# Altium project ControlBoard.PrjPcb (part 1 of 8)
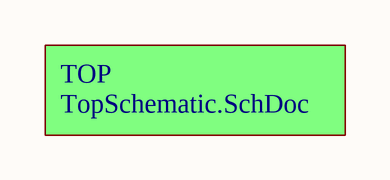
[diagram p0: TitlePage.SchDoc]
17 sheets, 291 parts. Net scope: flat (ports and power ports of the same name join across sheets).
Board file: ControlBoard.PcbDoc
Sheets:
  TitlePage.SchDoc
    TOP = TopSchematic.SchDoc
      U_Mcu = Mcu.SchDoc
        U_McuSupply = McuSupply.SchDoc
      U_CAN = CAN.SchDoc
      U_DIgitalInputs = DIgitalInputs.SchDoc
      U_DigitalOutputs = DigitalOutputs.SchDoc
      U_ExternalConnectors = ExternalConnectors.SchDoc
      U_CAN = CAN.SchDoc
      U_PowerBoardConnector = PowerBoardConnector.SchDoc
      U_Mems = Mems.SchDoc
      U_PhaseCurrents = PhaseCurrents.SchDoc
      U_PositionSense = Resolver.SchDoc
      U_ResistiveTempSensors = ResistiveTempSensors.SchDoc
      U_Supply = Supply.SchDoc
      U_UserInterface = UserInterface.SchDoc
      U_Voltages = Voltages.SchDoc
      U_Encoder = Encoder.SchDoc

## Sheet TitlePage.SchDoc: Title
size A4; SchTemplateVer: V2.0; Author: Adam Mizerkiewicz; CompanyName: Adam Mizerkiewicz; DrawnBy: Adam Mizerkiewicz; Engineer: Adam Mizerkiewicz; Organization: Adam Mizerkiewicz; Address1: Sarnia 2/19; Address2: 61-058 Poznań; Revision: 0.0

### Sub-sheets
TOP = TopSchematic.SchDoc: no entries

### Notes on the sheet
- Revision
  =Revision
- Sheet
  =SheetNumber / =SheetTotal

## Sheet TopSchematic.SchDoc: Title
size A4; SchTemplateVer: V2.0; Author: Adam Mizerkiewicz; CompanyName: Adam Mizerkiewicz; DrawnBy: Adam Mizerkiewicz; Engineer: Adam Mizerkiewicz; Organization: Adam Mizerkiewicz; Address1: Sarnia 2/19; Address2: 61-058 Poznań; Revision: 0.0; SheetNumber: 2; SheetTotal: 18
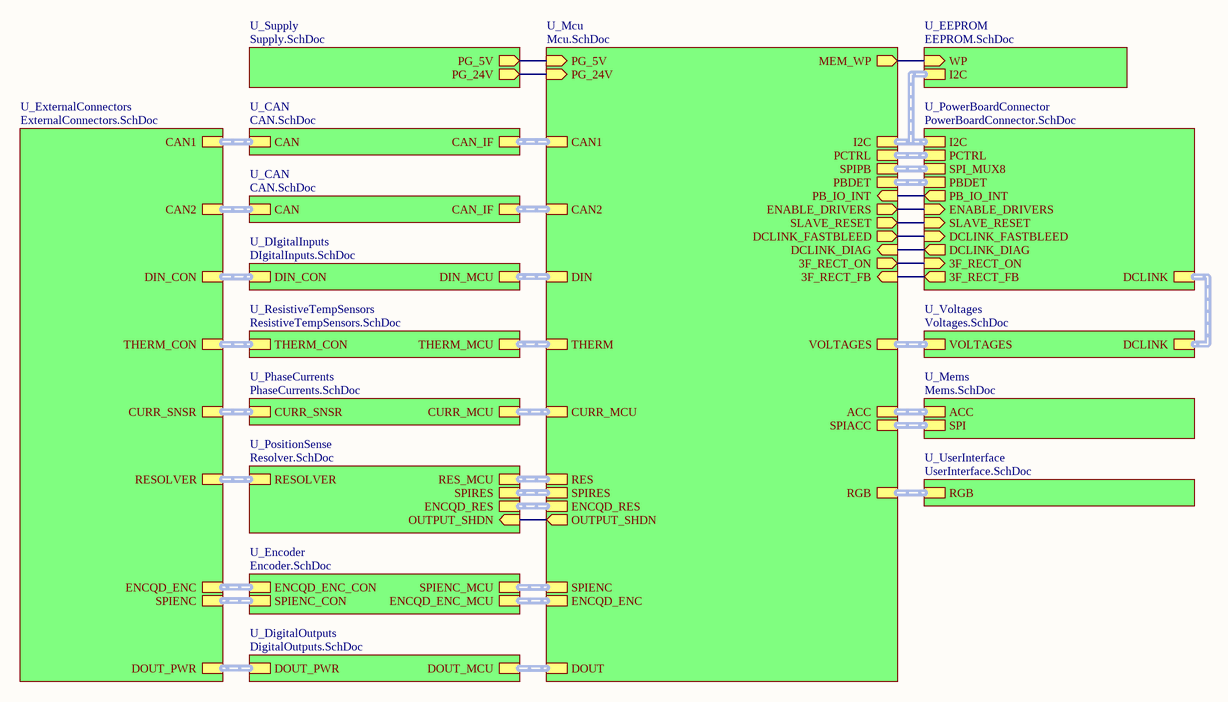
[diagram p1: TopSchematic.SchDoc]

### Sub-sheets
U_CAN = CAN.SchDoc: CAN_IF (harness CAN_IF), CAN (harness CAN)
U_CAN = CAN.SchDoc: CAN_IF (harness CAN_IF), CAN (harness CAN)
U_DIgitalInputs = DIgitalInputs.SchDoc: DIN_CON (harness DIN_CON), DIN_MCU (harness DIN_MCU)
U_DigitalOutputs = DigitalOutputs.SchDoc: DOUT_MCU (harness DOUT_MCU), DOUT_PWR (harness DOUT_PWR)
U_EEPROM = EEPROM.SchDoc (file not in this document): I2C (harness I2C), WP (in)
U_Encoder = Encoder.SchDoc: SPIENC_MCU (harness SPI), ENCQD_ENC_MCU (harness ENCQD), SPIENC_CON (harness SPI), ENCQD_ENC_CON (harness ENCQD)
U_ExternalConnectors = ExternalConnectors.SchDoc: CAN2 (harness CAN), DOUT_PWR (harness DOUT_PWR), DIN_CON (harness DIN_CON), THERM_CON (harness THERM_CON), RESOLVER (harness RESOLVER), SPIENC (harness SPI), CURR_SNSR (harness CURR_SNSR), CAN1 (harness CAN), ENCQD_ENC (harness ENCQD)
U_Mcu = Mcu.SchDoc: CAN1 (harness CAN_IF), CAN2 (harness CAN_IF), PCTRL (harness PCTRL), SPIPB (harness SPI_MUX8), SPIACC (harness SPI), SPIRES (harness SPI), ACC (harness ACC/GYRO), DIN (harness DIN_MCU), I2C (harness I2C), THERM (harness THERM_MCU), PBDET (harness PBDET), DOUT (harness DOUT_MCU), ENCQD_RES (harness ENCQD), SPIENC (harness SPI), RES (harness RESOLVER_IF), DCLINK_FASTBLEED (out), DCLINK_DIAG (in), PB_IO_INT (in), ENABLE_DRIVERS (out), SLAVE_RESET (out), 3F_RECT_ON (out), 3F_RECT_FB (in), VOLTAGES (harness VOLTAGES_MCU), RGB (harness RGB), ENCQD_ENC (harness ENCQD), CURR_MCU (harness CURR_MCU), OUTPUT_SHDN (out), PG_5V (in), PG_24V (in), MEM_WP (out)
U_Mems = Mems.SchDoc: ACC (harness ACC/GYRO_IF), SPI (harness SPI)
U_PhaseCurrents = PhaseCurrents.SchDoc: CURR_SNSR (harness CURR_SNSR), CURR_MCU (harness CURR_MCU)
U_PositionSense = Resolver.SchDoc: RES_MCU (harness RESOLVER_IF), SPIRES (harness SPI), ENCQD_RES (harness ENCQD), RESOLVER (harness RESOLVER), OUTPUT_SHDN (in)
U_PowerBoardConnector = PowerBoardConnector.SchDoc: SPI_MUX8 (harness SPI_MUX8), PCTRL (harness PCTRL), DCLINK_FASTBLEED (in), DCLINK_DIAG (out), PB_IO_INT (out), DCLINK (harness DC_LINK), ENABLE_DRIVERS (in), SLAVE_RESET (in), 3F_RECT_ON (in), 3F_RECT_FB (out), I2C (harness I2C), PBDET (harness PBDET)
U_ResistiveTempSensors = ResistiveTempSensors.SchDoc: THERM_MCU (harness THERM_MCU), THERM_CON (harness THERM_CON)
U_Supply = Supply.SchDoc: PG_5V (out), PG_24V (out)
U_UserInterface = UserInterface.SchDoc: RGB (harness RGB)
U_Voltages = Voltages.SchDoc: DCLINK (harness DCLINK), VOLTAGES (harness VOLTAGES_MCU)

### Nets
(unnamed): sheet U_Mcu/DCLINK_FASTBLEED, sheet U_PowerBoardConnector/DCLINK_FASTBLEED
(unnamed): sheet U_Mcu/DCLINK_DIAG, sheet U_PowerBoardConnector/DCLINK_DIAG
(unnamed): sheet U_Mcu/PB_IO_INT, sheet U_PowerBoardConnector/PB_IO_INT
(unnamed): sheet U_Mcu/ENABLE_DRIVERS, sheet U_PowerBoardConnector/ENABLE_DRIVERS
(unnamed): sheet U_Mcu/SLAVE_RESET, sheet U_PowerBoardConnector/SLAVE_RESET
(unnamed): sheet U_Mcu/3F_RECT_ON, sheet U_PowerBoardConnector/3F_RECT_ON
(unnamed): sheet U_Mcu/3F_RECT_FB, sheet U_PowerBoardConnector/3F_RECT_FB
(unnamed): sheet U_Mcu/OUTPUT_SHDN, sheet U_PositionSense/OUTPUT_SHDN
(unnamed): sheet U_Mcu/PG_5V, sheet U_Supply/PG_5V
(unnamed): sheet U_Mcu/PG_24V, sheet U_Supply/PG_24V
(unnamed): sheet U_Mcu/MEM_WP, sheet U_EEPROM/WP

### Buses and harness runs
harness sheet U_CAN/CAN = sheet U_ExternalConnectors/CAN1
harness sheet U_CAN/CAN = sheet U_ExternalConnectors/CAN2
harness sheet U_CAN/CAN_IF = sheet U_Mcu/CAN1
harness sheet U_CAN/CAN_IF = sheet U_Mcu/CAN2
harness sheet U_DIgitalInputs/DIN_CON = sheet U_ExternalConnectors/DIN_CON
harness sheet U_DIgitalInputs/DIN_MCU = sheet U_Mcu/DIN
harness sheet U_DigitalOutputs/DOUT_MCU = sheet U_Mcu/DOUT
harness sheet U_DigitalOutputs/DOUT_PWR = sheet U_ExternalConnectors/DOUT_PWR
harness sheet U_EEPROM/I2C = sheet U_Mcu/I2C = sheet U_PowerBoardConnector/I2C
harness sheet U_Encoder/ENCQD_ENC_CON = sheet U_ExternalConnectors/ENCQD_ENC
harness sheet U_Encoder/ENCQD_ENC_MCU = sheet U_Mcu/ENCQD_ENC
harness sheet U_Encoder/SPIENC_CON = sheet U_ExternalConnectors/SPIENC
harness sheet U_Encoder/SPIENC_MCU = sheet U_Mcu/SPIENC
harness sheet U_ExternalConnectors/CURR_SNSR = sheet U_PhaseCurrents/CURR_SNSR
harness sheet U_ExternalConnectors/RESOLVER = sheet U_PositionSense/RESOLVER
harness sheet U_ExternalConnectors/THERM_CON = sheet U_ResistiveTempSensors/THERM_CON
harness sheet U_Mcu/ACC = sheet U_Mems/ACC
harness sheet U_Mcu/CURR_MCU = sheet U_PhaseCurrents/CURR_MCU
harness sheet U_Mcu/ENCQD_RES = sheet U_PositionSense/ENCQD_RES
harness sheet U_Mcu/PBDET = sheet U_PowerBoardConnector/PBDET
harness sheet U_Mcu/PCTRL = sheet U_PowerBoardConnector/PCTRL
harness sheet U_Mcu/RES = sheet U_PositionSense/RES_MCU
harness sheet U_Mcu/RGB = sheet U_UserInterface/RGB
harness sheet U_Mcu/SPIACC = sheet U_Mems/SPI
harness sheet U_Mcu/SPIPB = sheet U_PowerBoardConnector/SPI_MUX8
harness sheet U_Mcu/SPIRES = sheet U_PositionSense/SPIRES
harness sheet U_Mcu/THERM = sheet U_ResistiveTempSensors/THERM_MCU
harness sheet U_Mcu/VOLTAGES = sheet U_Voltages/VOLTAGES
harness sheet U_PowerBoardConnector/DCLINK = sheet U_Voltages/DCLINK

### Notes on the sheet
- Revision
  =Revision
- Sheet
  =SheetNumber / =SheetTotal

## Sheet Mcu.SchDoc: Title
size A4; SchTemplateVer: V2.0; Author: Adam Mizerkiewicz; CompanyName: Adam Mizerkiewicz; DrawnBy: Adam Mizerkiewicz; Engineer: Adam Mizerkiewicz; Organization: Adam Mizerkiewicz; Address1: Sarnia 2/19; Address2: 61-058 Poznań; Revision: 0.0; SheetNumber: 3; SheetTotal: 18
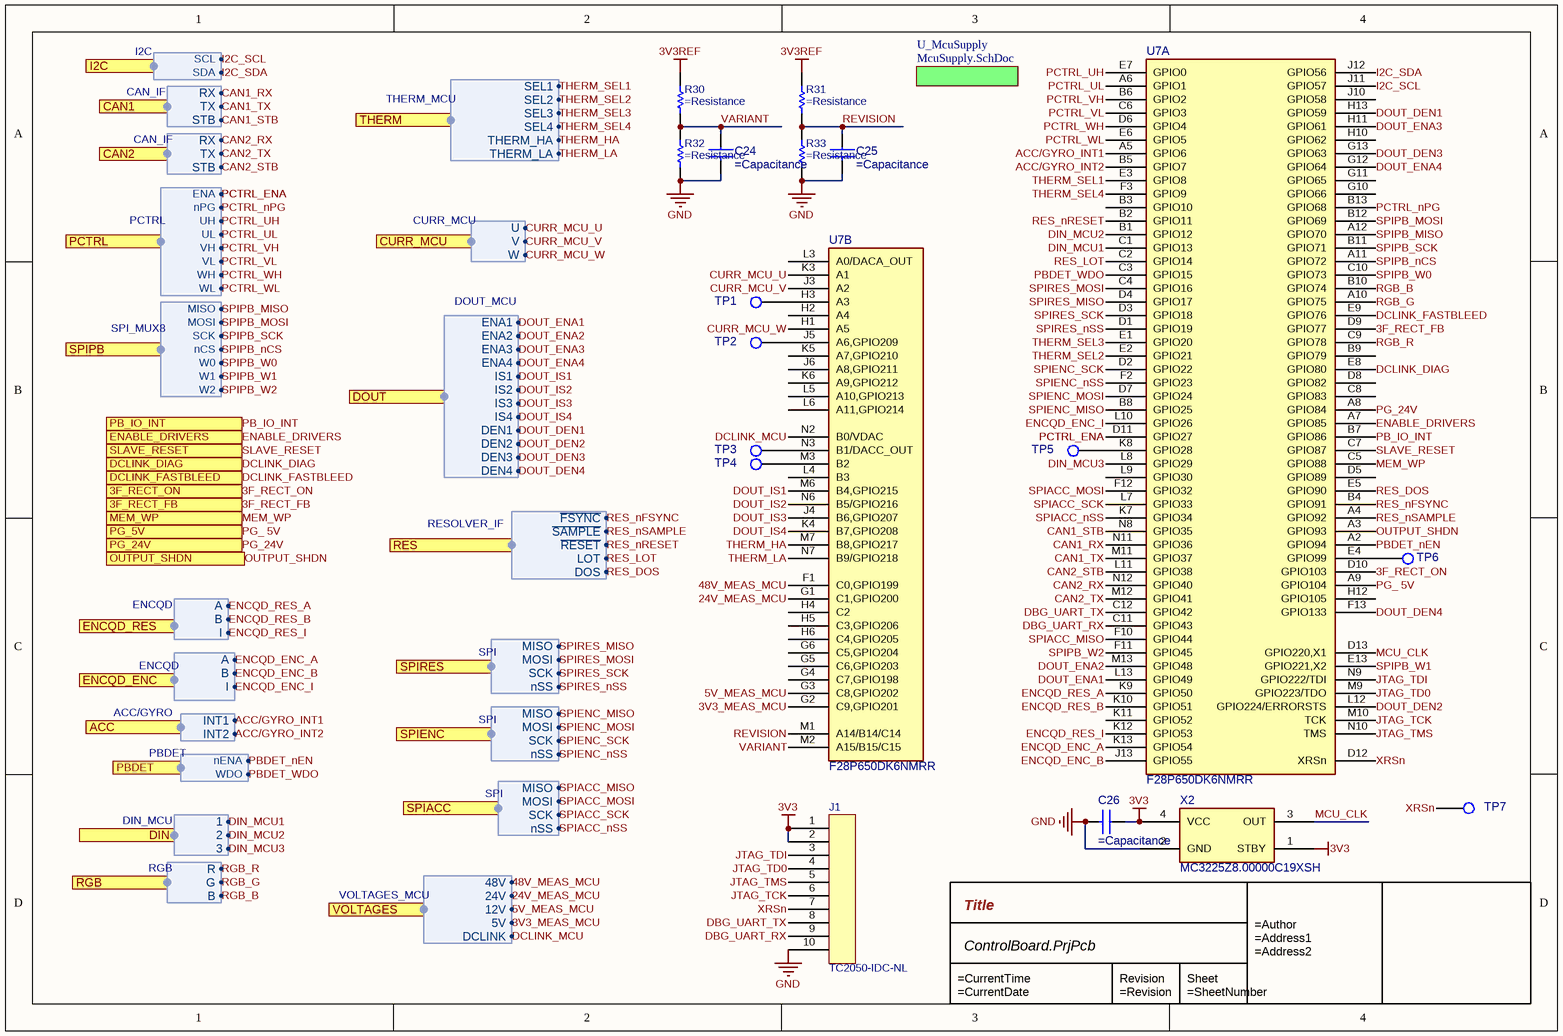
[diagram p2: Mcu.SchDoc]

### Parts
C24  (no value)  [C0402]
C25  (no value)  [C0402]
C26  (no value)  [C0402]
J1  TC2050-IDC-NL  [TC2050-IDC-NL]  (no BOM)
R30  (no value)  [R0402]
R31  (no value)  [R0402]
R32  (no value)  [R0402]
R33  (no value)  [R0402]
TP1  TP_SMT  [TP_SMT]  (value not drawn)  (no BOM)
TP2  TP_SMT  [TP_SMT]  (value not drawn)  (no BOM)
TP3  TP_SMT  [TP_SMT]  (value not drawn)  (no BOM)
TP4  TP_SMT  [TP_SMT]  (value not drawn)  (no BOM)
TP5  TP_SMT  [TP_SMT]  (value not drawn)  (no BOM)
TP6  TP_SMT  [TP_SMT]  (value not drawn)  (no BOM)
TP7  TP_SMT  [TP_SMT]  (value not drawn)  (no BOM)
U7  F28P650DK6NMRR  [NFBGA169]  (parts A,B of 3)
X2  MC3225Z8.00000C19XSH  [MC3225Z]

### Sub-sheets
U_McuSupply = McuSupply.SchDoc: no entries

### Ports
3F_RECT_FB (in), 3F_RECT_ON (out), ACC (harness ACC/GYRO), CAN1 (harness CAN_IF), CAN2 (harness CAN_IF), CURR_MCU (harness CURR_MCU), DCLINK_DIAG (in), DCLINK_FASTBLEED (out), DIN (harness DIN_MCU), DOUT (harness DOUT_MCU), ENABLE_DRIVERS (out), ENCQD_ENC (harness ENCQD), ENCQD_RES (harness ENCQD), I2C (harness I2C), MEM_WP (out), OUTPUT_SHDN (out), PB_IO_INT (in), PBDET (harness PBDET), PCTRL (harness PCTRL), PG_5V (in), PG_24V (in), RES (harness RESOLVER_IF), RGB (harness RGB), SLAVE_RESET (out), SPIACC (harness SPI), SPIENC (harness SPI), SPIPB (harness SPI_MUX8), SPIRES (harness SPI), THERM (harness THERM_MCU), VOLTAGES (harness VOLTAGES_MCU)

### Harnesses
CAN_IF: RX, TX, STB
SPI: MISO, MOSI, SCK, nSS
ACC/GYRO: INT1, INT2
SPI_MUX8: nCS, SCK, MISO, MOSI, W0, W1, W2
I2C: SDA, SCL
PCTRL: UH, UL, VH, VL, WH, WL, ENA, nPG
ENCQD: B, A, I
DIN_MCU: 1, 2, 3
PBDET: WDO, nENA
DOUT_MCU: ENA1, DEN1, ENA2, ENA3, ENA4, IS1, IS2, IS3, IS4, DEN2, DEN3, DEN4
RESOLVER_IF: ~{SAMPLE}, ~{FSYNC}, ~{RESET}, LOT, DOS
RGB: R, G, B
CURR_MCU: V, U, W
VOLTAGES_MCU: 24V, 12V, 5V, DCLINK, 48V
THERM_MCU: SEL1, SEL2, SEL3, SEL4, THERM_HA, THERM_LA

### Nets
3V3: C26.1 J1.1 J1.2 X2.1(STBY) X2.4(VCC)
3V3REF: R30.2 R31.2
GND: C24.2 C25.2 C26.2 J1.10 R32.1 R33.1 X2.2(GND)
3F_RECT_FB: U7.D9(GPIO77) ; port 3F_RECT_FB
3F_RECT_ON: U7.D10(GPIO103) ; port 3F_RECT_ON
3V3_MEAS_MCU: U7.G2(C9,GPIO201) ; port VOLTAGES.5V
5V_MEAS_MCU: U7.G3(C8,GPIO202) ; port VOLTAGES.12V
24V_MEAS_MCU: U7.G1(C1,GPIO200) ; port VOLTAGES.24V
48V_MEAS_MCU: U7.F1(C0,GPIO199) ; port VOLTAGES.48V
ACC/GYRO_INT1: U7.A5(GPIO6) ; port ACC.INT1
ACC/GYRO_INT2: U7.B5(GPIO7) ; port ACC.INT2
CAN1_RX: U7.N11(GPIO36) ; port CAN1.RX
CAN1_STB: U7.N8(GPIO35) ; port CAN1.STB
CAN1_TX: U7.M11(GPIO37) ; port CAN1.TX
CAN2_RX: U7.N12(GPIO40) ; port CAN2.RX
CAN2_STB: U7.L11(GPIO38) ; port CAN2.STB
CAN2_TX: U7.M12(GPIO41) ; port CAN2.TX
CURR_MCU_U: U7.K3(A1) ; port CURR_MCU.U
CURR_MCU_V: U7.J3(A2) ; port CURR_MCU.V
CURR_MCU_W: U7.H1(A5) ; port CURR_MCU.W
DBG_UART_RX: J1.9 U7.C11(GPIO43)
DBG_UART_TX: J1.8 U7.C12(GPIO42)
DCLINK_DIAG: U7.E8(GPIO80) ; port DCLINK_DIAG
DCLINK_FASTBLEED: U7.E9(GPIO76) ; port DCLINK_FASTBLEED
DCLINK_MCU: U7.N2(B0/VDAC) ; port VOLTAGES.DCLINK
DIN_MCU1: U7.C1(GPIO13) ; port DIN.1
DIN_MCU2: U7.B1(GPIO12) ; port DIN.2
DIN_MCU3: U7.L8(GPIO29) ; port DIN.3
DOUT_DEN1: U7.H13(GPIO59) ; port DOUT.DEN1
DOUT_DEN2: U7.L12(GPIO224/ERRORSTS) ; port DOUT.DEN2
DOUT_DEN3: U7.G13(GPIO63) ; port DOUT.DEN3
DOUT_DEN4: U7.F13(GPIO133) ; port DOUT.DEN4
DOUT_ENA1: U7.L13(GPIO49) ; port DOUT.ENA1
DOUT_ENA2: U7.M13(GPIO48) ; port DOUT.ENA2
DOUT_ENA3: U7.H11(GPIO61) ; port DOUT.ENA3
DOUT_ENA4: U7.G12(GPIO64) ; port DOUT.ENA4
DOUT_IS1: U7.M6(B4,GPIO215) ; port DOUT.IS1
DOUT_IS2: U7.N6(B5/GPIO216) ; port DOUT.IS2
DOUT_IS3: U7.J4(B6,GPIO207) ; port DOUT.IS3
DOUT_IS4: U7.K4(B7,GPIO208) ; port DOUT.IS4
ENABLE_DRIVERS: U7.A7(GPIO85) ; port ENABLE_DRIVERS
ENCQD_ENC_A: U7.K13(GPIO54) ; port ENCQD_ENC.A
ENCQD_ENC_B: U7.J13(GPIO55) ; port ENCQD_ENC.B
ENCQD_ENC_I: U7.L10(GPIO26) ; port ENCQD_ENC.I
ENCQD_RES_A: U7.K9(GPIO50) ; port ENCQD_RES.A
ENCQD_RES_B: U7.K10(GPIO51) ; port ENCQD_RES.B
ENCQD_RES_I: U7.K12(GPIO53) ; port ENCQD_RES.I
I2C_SCL: U7.J11(GPIO57) ; port I2C.SCL
I2C_SDA: U7.J12(GPIO56) ; port I2C.SDA
JTAG_TCK: J1.6 U7.M10(TCK)
JTAG_TD0: J1.4 U7.M9(GPIO223/TDO)
JTAG_TDI: J1.3 U7.N9(GPIO222/TDI)
JTAG_TMS: J1.5 U7.N10(TMS)
MCU_CLK: U7.D13(GPIO220,X1) X2.3(OUT)
MEM_WP: U7.C5(GPIO88) ; port MEM_WP
OUTPUT_SHDN: U7.A3(GPIO93) ; port OUTPUT_SHDN
PB_IO_INT: U7.B7(GPIO86) ; port PB_IO_INT
PBDET_nEN: U7.A2(GPIO94) ; port PBDET.nENA
PBDET_WDO: U7.C3(GPIO15) ; port PBDET.WDO
PCTRL_ENA: U7.D11(GPIO27) ; port PCTRL.ENA
PCTRL_nPG: U7.B13(GPIO68) ; port PCTRL.nPG
PCTRL_UH: U7.E7(GPIO0) ; port PCTRL.UH
PCTRL_UL: U7.A6(GPIO1) ; port PCTRL.UL
PCTRL_VH: U7.B6(GPIO2) ; port PCTRL.VH
PCTRL_VL: U7.C6(GPIO3) ; port PCTRL.VL
PCTRL_WH: U7.D6(GPIO4) ; port PCTRL.WH
PCTRL_WL: U7.E6(GPIO5) ; port PCTRL.WL
PG_24V: U7.A8(GPIO84) ; port PG_24V
PG_ 5V: U7.A9(GPIO104) ; port PG_5V
RES_DOS: U7.E5(GPIO90) ; port RES.DOS
RES_LOT: U7.C2(GPIO14) ; port RES.LOT
RES_nFSYNC: U7.B4(GPIO91) ; port RES.~{FSYNC}
RES_nRESET: U7.B2(GPIO11) ; port RES.~{RESET}
RES_nSAMPLE: U7.A4(GPIO92) ; port RES.~{SAMPLE}
REVISION: C25.1 R31.1 R33.2 U7.M1(A14/B14/C14)
RGB_B: U7.B10(GPIO74) ; port RGB.B
RGB_G: U7.A10(GPIO75) ; port RGB.G
RGB_R: U7.C9(GPIO78) ; port RGB.R
SLAVE_RESET: U7.C7(GPIO87) ; port SLAVE_RESET
SPIACC_MISO: U7.F10(GPIO44) ; port SPIACC.MISO
SPIACC_MOSI: U7.F12(GPIO32) ; port SPIACC.MOSI
SPIACC_nSS: U7.K7(GPIO34) ; port SPIACC.nSS
SPIACC_SCK: U7.L7(GPIO33) ; port SPIACC.SCK
SPIENC_MISO: U7.B8(GPIO25) ; port SPIENC.MISO
SPIENC_MOSI: U7.D7(GPIO24) ; port SPIENC.MOSI
SPIENC_nSS: U7.F2(GPIO23) ; port SPIENC.nSS
SPIENC_SCK: U7.D2(GPIO22) ; port SPIENC.SCK
SPIPB_MISO: U7.A12(GPIO70) ; port SPIPB.MISO
SPIPB_MOSI: U7.B12(GPIO69) ; port SPIPB.MOSI
SPIPB_nCS: U7.A11(GPIO72) ; port SPIPB.nCS
SPIPB_SCK: U7.B11(GPIO71) ; port SPIPB.SCK
SPIPB_W0: U7.C10(GPIO73) ; port SPIPB.W0
SPIPB_W1: U7.E13(GPIO221,X2) ; port SPIPB.W1
SPIPB_W2: U7.F11(GPIO45) ; port SPIPB.W2
SPIRES_MISO: U7.D4(GPIO17) ; port SPIRES.MISO
SPIRES_MOSI: U7.C4(GPIO16) ; port SPIRES.MOSI
SPIRES_nSS: U7.D1(GPIO19) ; port SPIRES.nSS
SPIRES_SCK: U7.D3(GPIO18) ; port SPIRES.SCK
THERM_HA: U7.M7(B8,GPIO217) ; port THERM.THERM_HA
THERM_LA: U7.N7(B9/GPIO218) ; port THERM.THERM_LA
THERM_SEL1: U7.E3(GPIO8) ; port THERM.SEL1
THERM_SEL2: U7.E2(GPIO21) ; port THERM.SEL2
THERM_SEL3: U7.E1(GPIO20) ; port THERM.SEL3
THERM_SEL4: U7.F3(GPIO9) ; port THERM.SEL4
VARIANT: C24.1 R30.1 R32.2 U7.M2(A15/B15/C15)
XRSn: J1.7 TP7.1 U7.D12(XRSn)
NetTP1_1: TP1.1 U7.H3(A3)
NetTP2_1: TP2.1 U7.J5(A6,GPIO209)
NetTP3_1: TP3.1 U7.N3(B1/DACC_OUT)
NetTP4_1: TP4.1 U7.M3(B2)
NetTP5_1: TP5.1 U7.K8(GPIO28)
NetTP6_1: TP6.1 U7.E4(GPIO99)

Not connected (* = marked no-connect by the designer): U7 B3(GPIO10) B9(GPIO79) C8(GPIO83) D5(GPIO89) D8(GPIO82) G4(C7,GPIO198) G5(C6,GPIO203) G6(C5,GPIO204) G10(GPIO66) G11(GPIO65) H2(A4) H4(C2) H5(C3,GPIO206) H6(C4,GPIO205) H10(GPIO62) H12(GPIO105) J6(A8,GPIO211) J10(GPIO58) K5(A7,GPIO210) K6(A9,GPIO212) K11(GPIO52) L3(A0/DACA_OUT) L4(B3) L5(A10,GPIO213) L6(A11,GPIO214) L9(GPIO30)

### Notes on the sheet
- Revision
  =Revision
- Sheet
  =SheetNumber / =SheetTotal

### Library data of the parts
C24 C25 = CAP0402-0.1uF-50V: Multilayer Ceramic Capacitors MLCC - SMD/SMT 50V 1000pF C0G 0402 2%; Manufacturer: Walsin Technologies; Manufacturer Part Number: 0402B104K500CT; Capacitance: 100nF; Material: 4241ConductorMaterial; Value: 100nF; Tolerance: 10%; Dielectric: 1511DielectricType; Supplier: Digikey; Supplier Part Number: 1292-1176-1-ND; RoHS: Yes; Category: Ceramic Capacitors; Stock: 109567; Pricing: 1=0,08, 10=0,005, 100=0,0032, 1000=0,0024 (USD); Mounting Technology: Surface Mount; Case/Package: 0402; Case Code (Imperial): 0402; Case Code (Metric): 1005; Min Operating Temperature: -55°C; Max Operating Temperature: 125°C; Packaging: Cut Tape; Voltage Rating: 50V; Series: -; Voltage Rating (DC): 50V; Height: 550um; RoHS Compliant: Yes; Lead Free: 5697LeadFree; ComponentLink1URL: http://datasheet.octopart.com/0402B104K500CT-Walsin-Technologies-datasheet-26371553.pdf?src-supplier=Arrow+Electronics; ComponentLink1Description: http://datasheet.octopart.com/0402B104K500CT-Walsin-Technologies-datasheet-26371553.pdf?src-supplier=Arrow+Electronics; ComponentLink2URL: http://datasheet.octopart.com/0402B104K500CT-Walsin-Technologies-datasheet-26371553.pdf?src-supplier=Verical; ComponentLink2Description: http://datasheet.octopart.com/0402B104K500CT-Walsin-Technologies-datasheet-26371553.pdf?src-supplier=Verical; ComponentLink3URL: http://www.passivecomponent.com/indexsea/0402B104K500CT-IE.pdf?src-supplier=Digikey; ComponentLink3Description: http://www.passivecomponent.com/indexsea/0402B104K500CT-IE.pdf?src-supplier=Digikey; ComponentLink4URL: http://datasheet.octopart.com/0402B104K500CT-Walsin-Technologies-datasheet-26371553.pdf?src-supplier=Rs; ComponentLink4Description: http://datasheet.octopart.com/0402B104K500CT-Walsin-Technologies-datasheet-26371553.pdf?src-supplier=Rs; ComponentLink5URL: https://datasheet.octopart.com/0402B104K500CT-Walsin-Technologies-datasheet-128065749.pdf?src-supplier=Future+Electronics; ComponentLink5Description: https://datasheet.octopart.com/0402B104K500CT-Walsin-Technologies-datasheet-128065749.pdf?src-supplier=Future+Electronics; ComponentLink6URL: http://datasheet.octopart.com/0402B104K500CT-Walsin-Technologies-datasheet-26371553.pdf?src-supplier=Farnell; ComponentLink6Description: http://datasheet.octopart.com/0402B104K500CT-Walsin-Technologies-datasheet-26371553.pdf?src-supplier=Farnell; ComponentLink7URL: http://datasheet.octopart.com/0402B104K500CT-Walsin-Technologies-datasheet-26371553.pdf?src-supplier=Newark; ComponentLink7Description: http://datasheet.octopart.com/0402B104K500CT-Walsin-Technologies-datasheet-26371553.pdf?src-supplier=Newark; ComponentLink8URL: http://datasheet.octopart.com/0402B104K500CT-Walsin-Technologies-datasheet-26371553.pdf?src-supplier=Mouser; ComponentLink8Description: http://datasheet.octopart.com/0402B104K500CT-Walsin-Technologies-datasheet-26371553.pdf?src-supplier=Mouser; ComponentLink9URL: http://datasheet.octopart.com/0402B104K500CT-Walsin-Technologies-datasheet-26371553.pdf?src-supplier=Digikey; ComponentLink9Description: http://datasheet.octopart.com/0402B104K500CT-Walsin-Technologies-datasheet-26371553.pdf?src-supplier=Digikey; ComponentLink10URL: https://datasheet.octopart.com/0402B104K500CT-Walsin-Technologies-datasheet-62066062.pdf?src-supplier=TME; ComponentLink10Description: https://datasheet.octopart.com/0402B104K500CT-Walsin-Technologies-datasheet-62066062.pdf?src-supplier=TME; ComponentLink11URL: http://datasheet.octopart.com/0402B104K500CT-Walsin-Technologies-datasheet-26371553.pdf?src-supplier=Freelance+Electronics; ComponentLink11Description: http://datasheet.octopart.com/0402B104K500CT-Walsin-Technologies-datasheet-26371553.pdf?src-supplier=Freelance+Electronics; ComponentLink12URL: http://datasheet.octopart.com/0402B104K500CT-Walsin-Technologies-datasheet-26371553.pdf?src-supplier=Component+Sense; ComponentLink12Description: http://datasheet.octopart.com/0402B104K500CT-Walsin-Technologies-datasheet-26371553.pdf?src-supplier=Component+Sense; ComponentLink13URL: http://datasheet.octopart.com/0402B104K500CT-Walsin-Technologies-datasheet-26371553.pdf?src-supplier=NAC+Semi; ComponentLink13Description: http://datasheet.octopart.com/0402B104K500CT-Walsin-Technologies-datasheet-26371553.pdf?src-supplier=NAC+Semi; ComponentLink14URL: https://datasheet.octopart.com/0402B104K500CT-Walsin-Technologies-datasheet-136037192.pdf?src-supplier=TECHDesign; ComponentLink14Description: https://datasheet.octopart.com/0402B104K500CT-Walsin-Technologies-datasheet-136037192.pdf?src-supplier=TECHDesign; Supplier 1: Digikey; Supplier Part Number 1: 1292-1176-1-ND; China RoHS: Compliant; Depth: 500µm; Dielectric Material: Ceramic; Length: 1mm; Lifecycle Status: Production; Pins: 2; Number of Terminals: 2; REACH SVHC: Yes; Termination: SMD/SMT; Thickness: 558.8µm; Width: 500µm; ComponentLink15URL: https://datasheet.octopart.com:443/C0402C102G5GACTU-KEMET-datasheet-178132257.pdf?src-supplier=IHS; ComponentLink15Description: https://datasheet.octopart.com:443/C0402C102G5GACTU-KEMET-datasheet-178132257.pdf?src-supplier=IHS; ComponentLink16URL: https://datasheet.octopart.com:443/C0402C102G5GAC7867-KEMET-datasheet-10540709.pdf?src-supplier=IHS; ComponentLink16Description: https://datasheet.octopart.com:443/C0402C102G5GAC7867-KEMET-datasheet-10540709.pdf?src-supplier=IHS; ComponentLink17URL: https://datasheet.octopart.com:443/C0402C102G5GACTU-KEMET-datasheet-137357759.pdf?src-supplier=Upverter; ComponentLink17Description: https://datasheet.octopart.com:443/C0402C102G5GACTU-KEMET-datasheet-137357759.pdf?src-supplier=Upverter; ComponentLink18URL: https://datasheet.octopart.com:443/C0402C102G5GACTU-KEMET-datasheet-149521574.pdf?src-supplier=Farnell; ComponentLink18Description: https://datasheet.octopart.com:443/C0402C102G5GACTU-KEMET-datasheet-149521574.pdf?src-supplier=Farnell; ComponentLink19URL: https://datasheet.octopart.com:443/C0402C102G5GACTU-KEMET-datasheet-102158736.pdf?src-supplier=Newark; ComponentLink19Description: https://datasheet.octopart.com:443/C0402C102G5GACTU-KEMET-datasheet-102158736.pdf?src-supplier=Newark; ComponentLink20URL: https://datasheet.octopart.com:443/C0402C102G5GACTU-KEMET-datasheet-68331921.pdf?src-supplier=element14+APAC; ComponentLink20Description: https://datasheet.octopart.com:443/C0402C102G5GACTU-KEMET-datasheet-68331921.pdf?src-supplier=element14+APAC; ComponentLink21URL: https://datasheet.octopart.com:443/C0402C102G5GACTU-KEMET-datasheet-178087919.pdf?src-supplier=element14+APAC; ComponentLink21Description: https://datasheet.octopart.com:443/C0402C102G5GACTU-KEMET-datasheet-178087919.pdf?src-supplier=element14+APAC; ComponentLink22URL: https://datasheet.octopart.com:443/C0402C102G5GACTU-KEMET-datasheet-157246123.pdf?src-supplier=Electro+Sonic; ComponentLink22Description: https://datasheet.octopart.com:443/C0402C102G5GACTU-KEMET-datasheet-157246123.pdf?src-supplier=Electro+Sonic; ComponentLink23URL: https://datasheet.octopart.com/C0402C102G5GACTU-KEMET-datasheet-84169754.pdf; ComponentLink23Description: https://datasheet.octopart.com/C0402C102G5GACTU-KEMET-datasheet-84169754.pdf; ComponentLink24URL: https://datasheet.octopart.com:443/C0402C102G5GACTU-Kemet-datasheet-11974058.pdf?src-supplier=Arrow+Electronics; ComponentLink24Description: https://datasheet.octopart.com:443/C0402C102G5GACTU-Kemet-datasheet-11974058.pdf?src-supplier=Arrow+Electronics
C26 = CAP0402-0.1uF-50V: CAP CER 0.1UF 50V X7R 0402; Manufacturer: Walsin Technologies; Manufacturer Part Number: 0402B104K500CT; Capacitance: 100nF; Material: 4241ConductorMaterial; Value: 100nF; Tolerance: 10%; Dielectric: 1511DielectricType; Supplier: Digikey; Supplier Part Number: 1292-1176-1-ND; RoHS: Yes; Category: Ceramic Capacitors; Stock: 109567; Pricing: 1=0,08, 10=0,005, 100=0,0032, 1000=0,0024 (USD); Mounting Technology: Surface Mount; Case/Package: 0402; Case Code (Imperial): 0402; Case Code (Metric): 1005; Min Operating Temperature: -55°C; Max Operating Temperature: 125°C; Packaging: Cut Tape; Voltage Rating: 50V; Series: -; Voltage Rating (DC): 50V; Height: 550um; RoHS Compliant: Yes; Lead Free: 5697LeadFree; ComponentLink1URL: http://datasheet.octopart.com/0402B104K500CT-Walsin-Technologies-datasheet-26371553.pdf?src-supplier=Arrow+Electronics; ComponentLink1Description: http://datasheet.octopart.com/0402B104K500CT-Walsin-Technologies-datasheet-26371553.pdf?src-supplier=Arrow+Electronics; ComponentLink2URL: http://datasheet.octopart.com/0402B104K500CT-Walsin-Technologies-datasheet-26371553.pdf?src-supplier=Verical; ComponentLink2Description: http://datasheet.octopart.com/0402B104K500CT-Walsin-Technologies-datasheet-26371553.pdf?src-supplier=Verical; ComponentLink3URL: http://www.passivecomponent.com/indexsea/0402B104K500CT-IE.pdf?src-supplier=Digikey; ComponentLink3Description: http://www.passivecomponent.com/indexsea/0402B104K500CT-IE.pdf?src-supplier=Digikey; ComponentLink4URL: http://datasheet.octopart.com/0402B104K500CT-Walsin-Technologies-datasheet-26371553.pdf?src-supplier=Rs; ComponentLink4Description: http://datasheet.octopart.com/0402B104K500CT-Walsin-Technologies-datasheet-26371553.pdf?src-supplier=Rs; ComponentLink5URL: https://datasheet.octopart.com/0402B104K500CT-Walsin-Technologies-datasheet-128065749.pdf?src-supplier=Future+Electronics; ComponentLink5Description: https://datasheet.octopart.com/0402B104K500CT-Walsin-Technologies-datasheet-128065749.pdf?src-supplier=Future+Electronics; ComponentLink6URL: http://datasheet.octopart.com/0402B104K500CT-Walsin-Technologies-datasheet-26371553.pdf?src-supplier=Farnell; ComponentLink6Description: http://datasheet.octopart.com/0402B104K500CT-Walsin-Technologies-datasheet-26371553.pdf?src-supplier=Farnell; ComponentLink7URL: http://datasheet.octopart.com/0402B104K500CT-Walsin-Technologies-datasheet-26371553.pdf?src-supplier=Newark; ComponentLink7Description: http://datasheet.octopart.com/0402B104K500CT-Walsin-Technologies-datasheet-26371553.pdf?src-supplier=Newark; ComponentLink8URL: http://datasheet.octopart.com/0402B104K500CT-Walsin-Technologies-datasheet-26371553.pdf?src-supplier=Mouser; ComponentLink8Description: http://datasheet.octopart.com/0402B104K500CT-Walsin-Technologies-datasheet-26371553.pdf?src-supplier=Mouser; ComponentLink9URL: http://datasheet.octopart.com/0402B104K500CT-Walsin-Technologies-datasheet-26371553.pdf?src-supplier=Digikey; ComponentLink9Description: http://datasheet.octopart.com/0402B104K500CT-Walsin-Technologies-datasheet-26371553.pdf?src-supplier=Digikey; ComponentLink10URL: https://datasheet.octopart.com/0402B104K500CT-Walsin-Technologies-datasheet-62066062.pdf?src-supplier=TME; ComponentLink10Description: https://datasheet.octopart.com/0402B104K500CT-Walsin-Technologies-datasheet-62066062.pdf?src-supplier=TME; ComponentLink11URL: http://datasheet.octopart.com/0402B104K500CT-Walsin-Technologies-datasheet-26371553.pdf?src-supplier=Freelance+Electronics; ComponentLink11Description: http://datasheet.octopart.com/0402B104K500CT-Walsin-Technologies-datasheet-26371553.pdf?src-supplier=Freelance+Electronics; ComponentLink12URL: http://datasheet.octopart.com/0402B104K500CT-Walsin-Technologies-datasheet-26371553.pdf?src-supplier=Component+Sense; ComponentLink12Description: http://datasheet.octopart.com/0402B104K500CT-Walsin-Technologies-datasheet-26371553.pdf?src-supplier=Component+Sense; ComponentLink13URL: http://datasheet.octopart.com/0402B104K500CT-Walsin-Technologies-datasheet-26371553.pdf?src-supplier=NAC+Semi; ComponentLink13Description: http://datasheet.octopart.com/0402B104K500CT-Walsin-Technologies-datasheet-26371553.pdf?src-supplier=NAC+Semi; ComponentLink14URL: https://datasheet.octopart.com/0402B104K500CT-Walsin-Technologies-datasheet-136037192.pdf?src-supplier=TECHDesign; ComponentLink14Description: https://datasheet.octopart.com/0402B104K500CT-Walsin-Technologies-datasheet-136037192.pdf?src-supplier=TECHDesign; Supplier 1: Digikey; Supplier Part Number 1: 1292-1176-1-ND
J1 = TC2050-IDC-NL: TagConnect TC2050-IDC-NL
R30-R33 = RES0402-1k-1%: Res Thick Film 0402 1K Ohm 1% 0.063W(1/16W) ±50ppm/C Pad SMD Automotive T/R; Manufacturer: Vishay; Manufacturer Part Number: CRCW04021K00FHEDP; Resistance: 1kΩ; Max Power Dissipation: 63mW; Value: 1kΩ; Temperature Coefficient: 50ppm/°C; Voltage Rating: 50V; Supplier 1: DigiKey; Supplier Part Number 1: CRCW04021K00FHEDP-ND; Supplier: DigiKey; Supplier Part Number: CRCW04021K00FHEDP-ND; RoHS: Compliant; Category: Chip SMD Resistors; Pricing: 10000=0,03252 (USD); Case/Package: 0402; China RoHS: Non-Compliant; Composition: Thick Film; Contact Plating: Tin; Depth: 500µm; Features: Automotive AEC-Q200; Height: 350µm; Length: 990.6µm; Lifecycle Status: Production; Max Operating Temperature: 155°C; Military Standard: Not; Min Operating Temperature: -55°C; Mounting Technology: Surface Mount; Number of Terminals: 2; Number of Terminations: 2; Packaging: Tape & Reel; Power Dissipation: 63mW; Power Rating: 63mW; Radiation Hardening: No; REACH SVHC: Yes; Tolerance: 1%; Width: 500µm; Working Voltage: 50V; ComponentLink1URL: https://datasheet.octopart.com:443/CRCW04021K00FHEDP-Vishay-datasheet-182027415.pdf?src-supplier=IHS; ComponentLink1Description: https://datasheet.octopart.com:443/CRCW04021K00FHEDP-Vishay-datasheet-182027415.pdf?src-supplier=IHS; ComponentLink2URL: https://datasheet.octopart.com:443/CRCW04021K00FHEDP-Vishay-Dale-datasheet-141207190.pdf?src-supplier=Upverter; ComponentLink2Description: https://datasheet.octopart.com:443/CRCW04021K00FHEDP-Vishay-Dale-datasheet-141207190.pdf?src-supplier=Upverter; ComponentLink3URL: http://sigma.octopart.com:80/rohs_statement/Vishay-company-15.pdf?src-supplier=Compliance+Statements; ComponentLink3Description: http://sigma.octopart.com:80/rohs_statement/Vishay-company-15.pdf?src-supplier=Compliance+Statements
TP1-TP7 = TP: TEST POINT
U7 = F28P650DK6NMRR_1: C2000™ 32-bit MCU, 2x C28x+CLA CPU, Lock Step, 1.28-MB flash, 16-b ADC, HRPWM, EtherCAT, CAN-FD, AES 169-NFBGA -40 to...; Manufacturer: Texas Instruments; Manufacturer Lifecycle Status: ACTIVE; Number of UART Channels: 4; Supplier 1: DigiKey; Supplier Part Number 1: 296-F28P650DK6NMRRTR-ND; Supplier: DigiKey; Supplier Part Number: 296-F28P650DK6NMRRTR-ND; Manufacturer Part Number: F28P650DK6NMRR; RoHS: Compliant; Category: Microcontrollers; Pricing: 1000=11,46098 (USD); Height: 0m; Length: 9mm; Lifecycle Status: Production; Pins: 169; Thickness: 650µm; Width: 9mm; ComponentLink1URL: https://sigma.octopart.com:443/170336436/technical_drawing/Texas-Instruments-F28P650DK6NMRR.pdf?src-supplier=Texas+Instruments; ComponentLink1Description: https://sigma.octopart.com:443/170336436/technical_drawing/Texas-Instruments-F28P650DK6NMRR.pdf?src-supplier=Texas+Instruments; ComponentLink2URL: https://octopart.com:443/opatz8j6/c1?t=APRw11tpYPVjWCcH60awOXt0cGwImscANGC7li7_cx_Agxm915MhAZTObmDghc9eZOaw_mHD48OCZSRp73lGddKWUBe5fw7JdS3oY6-WaShYciiLLEgoA4x4huAl_qcDmd35tthWJciG_j9G0_KiT0SpOlZap5xOApFweMh2aZbGRedpPOVXVEDON4Icb6hkm9W7qm4-y49tBp6shpQILr3wInC47Ns5REcOk_fqp6GFBCGfdNNlvimY7LhF-z2TQJYRCUXuPMF8jbjKwibXb4IEVHm3troRaaxBm4vGhw5rMNpdyp6Yfknc0rFnvpyRKpgralAt9vXUJ0VNHXN8-zHJova3rwODBasGVAO6XlgY1J4nqzjFJr64ola8gSl7fMvjJfjBTM6KoBMDgg&src-supplier=Texas+Instruments; ComponentLink2Description: https://octopart.com:443/opatz8j6/c1?t=APRw11tpYPVjWCcH60awOXt0cGwImscANGC7li7_cx_Agxm915MhAZTObmDghc9eZOaw_mHD48OCZSRp73lGddKWUBe5fw7JdS3oY6-WaShYciiLLEgoA4x4huAl_qcDmd35tthWJciG_j9G0_KiT0SpOlZap5xOApFweMh2aZbGRedpPOVXVEDON4Icb6hkm9W7qm4-y49tBp6shpQILr3wInC47Ns5REcOk_fqp6GFBCGfdNNlvimY7LhF-z2TQJYRCUXuPMF8jbjKwibXb4IEVHm3troRaaxBm4vGhw5rMNpdyp6Yfknc0rFnvpyRKpgralAt9vXUJ0VNHXN8-zHJova3rwODBasGVAO6XlgY1J4nqzjFJr64ola8gSl7fMvjJfjBTM6KoBMDgg&src-supplier=Texas+Instruments; ComponentLink3URL: http://sigma.octopart.com:80/reach_statement/Texas-Instruments-company-64.pdf?src-supplier=Compliance+Statements; ComponentLink3Description: http://sigma.octopart.com:80/reach_statement/Texas-Instruments-company-64.pdf?src-supplier=Compliance+Statements; ComponentLink4URL: http://sigma.octopart.com:80/conflict_mineral_statement/Texas-Instruments-company-63.pdf?src-supplier=Compliance+Statements; ComponentLink4Description: http://sigma.octopart.com:80/conflict_mineral_statement/Texas-Instruments-company-63.pdf?src-supplier=Compliance+Statements
X2 = MC3225Z8.00000C19XSH: Crystal Oscillator 8MHz 1.8V/2.5V/3.3V 15pF 4-Pin SMD T/R; Manufacturer: KYOCERA AVX; Fall Time: 1.5ns; Frequency Stability: 30ppm; Low Level Output Current: 4mA; Max Supply Current: 6.5mA; Max Supply Voltage: 3.63V; Min Supply Voltage: 1.71V; Supplier 1: DigiKey; Supplier Part Number 1: 478-MC3225Z8.00000C19XSHCT-ND; Supplier: DigiKey; Supplier Part Number: 478-MC3225Z8.00000C19XSHCT-ND; Manufacturer Part Number: MC3225Z8.00000C19XSH; RoHS: Compliant; Category: Crystals; Stock: 5787; Pricing: 1=1,44, 10=1,248, 25=1,18, 50=1,131, 100=1,0842, 250=1,02532, 500=0,98292, 1000=0,9423 (USD); Frequency: 8MHz; Lifecycle Status: Production; Load Capacitance: 15pF; Max Operating Temperature: 125°C; Min Operating Temperature: -40°C; Mounting Technology: Surface Mount; Number of Terminals: 4; REACH SVHC: Yes; Rise Time: 1.5ns; ComponentLink1URL: https://datasheet.octopart.com:443/MC3225Z8.00000C19XSH-KYOCERA-AVX-datasheet-165896879.pdf?src-supplier=IHS; ComponentLink1Description: https://datasheet.octopart.com:443/MC3225Z8.00000C19XSH-KYOCERA-AVX-datasheet-165896879.pdf?src-supplier=IHS; ComponentLink2URL: https://datasheet.octopart.com:443/MC3225Z80.0000C19XSH-KYOCERA-AVX-datasheet-180539762.pdf?src-supplier=IHS; ComponentLink2Description: https://datasheet.octopart.com:443/MC3225Z80.0000C19XSH-KYOCERA-AVX-datasheet-180539762.pdf?src-supplier=IHS; ComponentLink3URL: https://datasheet.octopart.com:443/MC3225Z8.00000C19XSH-KYOCERA-AVX-datasheet-188906256.pdf?src-supplier=TME; ComponentLink3Description: https://datasheet.octopart.com:443/MC3225Z8.00000C19XSH-KYOCERA-AVX-datasheet-188906256.pdf?src-supplier=TME; ComponentLink4URL: http://sigma.octopart.com:80/reach_statement/AVX-company-19.pdf?src-supplier=Compliance+Statements; ComponentLink4Description: http://sigma.octopart.com:80/reach_statement/AVX-company-19.pdf?src-supplier=Compliance+Statements; ComponentLink5URL: http://sigma.octopart.com:80/conflict_mineral_statement/AVX-company-34.pdf?src-supplier=Compliance+Statements; ComponentLink5Description: http://sigma.octopart.com:80/conflict_mineral_statement/AVX-company-34.pdf?src-supplier=Compliance+Statements

## Sheet McuSupply.SchDoc: Title
size A4; SchTemplateVer: V2.0; Author: Adam Mizerkiewicz; CompanyName: Adam Mizerkiewicz; DrawnBy: Adam Mizerkiewicz; Engineer: Adam Mizerkiewicz; Organization: Adam Mizerkiewicz; Address1: Sarnia 2/19; Address2: 61-058 Poznań; Revision: 0.0
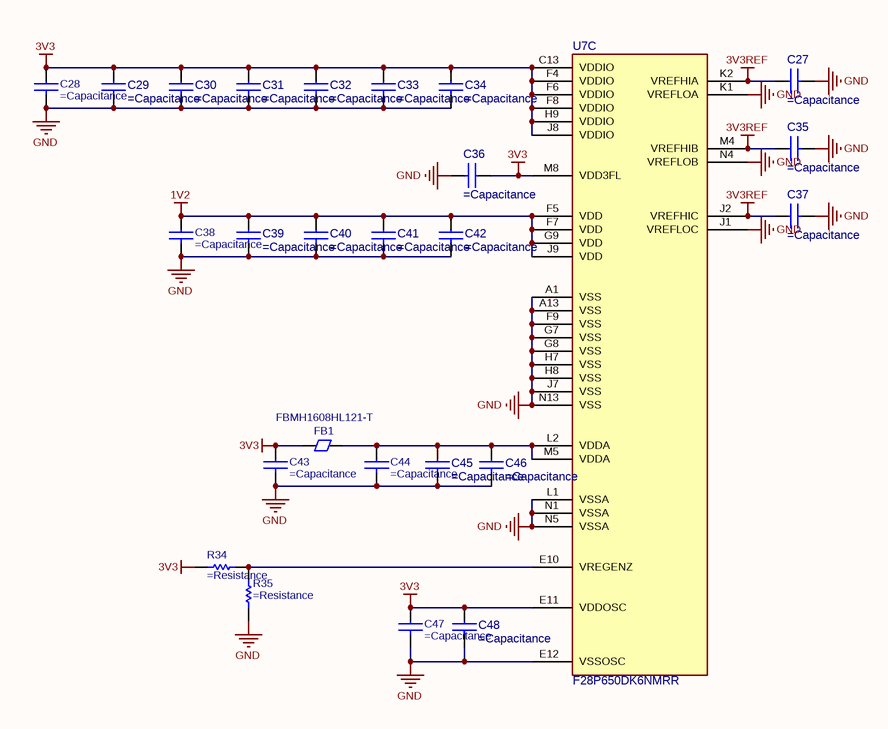
[diagram p3: McuSupply.SchDoc]

### Parts
C27  (no value)  [C0402]
C28  (no value)  [C0603]
C29  (no value)  [C0402]
C30  (no value)  [C0402]
C31  (no value)  [C0402]
C32  (no value)  [C0402]
C33  (no value)  [C0402]
C34  (no value)  [C0402]
C35  (no value)  [C0402]
C36  (no value)  [C0402]
C37  (no value)  [C0402]
C38  (no value)  [C0603]
C39  (no value)  [C0402]
C40  (no value)  [C0402]
C41  (no value)  [C0402]
C42  (no value)  [C0402]
C43  (no value)  [C0603]
C44  (no value)  [C0603]
C45  (no value)  [C0402]
C46  (no value)  [C0402]
C47  (no value)  [C0603]
C48  (no value)  [C0402]
FB1  FBMH1608HL121-T  [FB0603]
R34  (no value)  [R0402]
R35  (no value)  [R0402]
U7  F28P650DK6NMRR  [NFBGA169]  (part C of 3)

### Nets
1V2: C38.1 C39.1 C40.1 C41.1 C42.1 U7.F5(VDD) U7.F7(VDD) U7.G9(VDD) U7.J9(VDD)
3V3: C28.1 C29.1 C30.1 C31.1 C32.1 C33.1 C34.1 C36.1 C43.1 C47.1 C48.1 FB1.1 R34.2 U7.C13(VDDIO) U7.E11(VDDOSC) U7.F4(VDDIO) U7.F6(VDDIO) U7.F8(VDDIO) U7.H9(VDDIO) U7.J8(VDDIO) U7.M8(VDD3FL)
3V3REF: C27.1 C35.1 C37.1 U7.J2(VREFHIC) U7.K2(VREFHIA) U7.M4(VREFHIB)
GND: C27.2 C28.2 C29.2 C30.2 C31.2 C32.2 C33.2 C34.2 C35.2 C36.2 C37.2 C38.2 C39.2 C40.2 C41.2 C42.2 C43.2 C44.2 C45.2 C46.2 C47.2 C48.2 R35.1 U7.A1(VSS) U7.A13(VSS) U7.E12(VSSOSC) U7.F9(VSS) U7.G7(VSS) U7.G8(VSS) U7.H7(VSS) U7.H8(VSS) U7.J1(VREFLOC) U7.J7(VSS) U7.K1(VREFLOA) U7.L1(VSSA) U7.N1(VSSA) U7.N4(VREFLOB) U7.N5(VSSA) U7.N13(VSS)
NetC44_1: C44.1 C45.1 C46.1 FB1.2 U7.L2(VDDA) U7.M5(VDDA)
NetR34_1: R34.1 R35.2 U7.E10(VREGENZ)

### Notes on the sheet
- Revision
  =Revision
- Sheet
  =SheetNumber / =SheetTotal

### Library data of the parts
C27 C29-C37 C39-C42 C45 C46 C48 = CAP0402-0.1uF-50V: as C26 on sheet Mcu; Supplier: Digikey; Supplier Part Number: 1292-1176-1-ND; RoHS: Yes; Category: Ceramic Capacitors; Stock: 109567; Pricing: 1=0,08, 10=0,005, 100=0,0032, 1000=0,0024 (USD); Mounting Technology: Surface Mount; Case/Package: 0402; Case Code (Imperial): 0402; Case Code (Metric): 1005; Min Operating Temperature: -55°C; Max Operating Temperature: 125°C; Packaging: Cut Tape; Voltage Rating: 50V; Series: -; Voltage Rating (DC): 50V; Height: 550um; RoHS Compliant: Yes; Lead Free: 5697LeadFree; ComponentLink1URL: http://datasheet.octopart.com/0402B104K500CT-Walsin-Technologies-datasheet-26371553.pdf?src-supplier=Arrow+Electronics; ComponentLink1Description: http://datasheet.octopart.com/0402B104K500CT-Walsin-Technologies-datasheet-26371553.pdf?src-supplier=Arrow+Electronics; ComponentLink2URL: http://datasheet.octopart.com/0402B104K500CT-Walsin-Technologies-datasheet-26371553.pdf?src-supplier=Verical; ComponentLink2Description: http://datasheet.octopart.com/0402B104K500CT-Walsin-Technologies-datasheet-26371553.pdf?src-supplier=Verical; ComponentLink3URL: http://www.passivecomponent.com/indexsea/0402B104K500CT-IE.pdf?src-supplier=Digikey; ComponentLink3Description: http://www.passivecomponent.com/indexsea/0402B104K500CT-IE.pdf?src-supplier=Digikey; ComponentLink4URL: http://datasheet.octopart.com/0402B104K500CT-Walsin-Technologies-datasheet-26371553.pdf?src-supplier=Rs; ComponentLink4Description: http://datasheet.octopart.com/0402B104K500CT-Walsin-Technologies-datasheet-26371553.pdf?src-supplier=Rs; ComponentLink5URL: https://datasheet.octopart.com/0402B104K500CT-Walsin-Technologies-datasheet-128065749.pdf?src-supplier=Future+Electronics; ComponentLink5Description: https://datasheet.octopart.com/0402B104K500CT-Walsin-Technologies-datasheet-128065749.pdf?src-supplier=Future+Electronics; ComponentLink6URL: http://datasheet.octopart.com/0402B104K500CT-Walsin-Technologies-datasheet-26371553.pdf?src-supplier=Farnell; ComponentLink6Description: http://datasheet.octopart.com/0402B104K500CT-Walsin-Technologies-datasheet-26371553.pdf?src-supplier=Farnell; ComponentLink7URL: http://datasheet.octopart.com/0402B104K500CT-Walsin-Technologies-datasheet-26371553.pdf?src-supplier=Newark; ComponentLink7Description: http://datasheet.octopart.com/0402B104K500CT-Walsin-Technologies-datasheet-26371553.pdf?src-supplier=Newark; ComponentLink8URL: http://datasheet.octopart.com/0402B104K500CT-Walsin-Technologies-datasheet-26371553.pdf?src-supplier=Mouser; ComponentLink8Description: http://datasheet.octopart.com/0402B104K500CT-Walsin-Technologies-datasheet-26371553.pdf?src-supplier=Mouser; ComponentLink9URL: http://datasheet.octopart.com/0402B104K500CT-Walsin-Technologies-datasheet-26371553.pdf?src-supplier=Digikey; ComponentLink9Description: http://datasheet.octopart.com/0402B104K500CT-Walsin-Technologies-datasheet-26371553.pdf?src-supplier=Digikey; ComponentLink10URL: https://datasheet.octopart.com/0402B104K500CT-Walsin-Technologies-datasheet-62066062.pdf?src-supplier=TME; ComponentLink10Description: https://datasheet.octopart.com/0402B104K500CT-Walsin-Technologies-datasheet-62066062.pdf?src-supplier=TME; ComponentLink11URL: http://datasheet.octopart.com/0402B104K500CT-Walsin-Technologies-datasheet-26371553.pdf?src-supplier=Freelance+Electronics; ComponentLink11Description: http://datasheet.octopart.com/0402B104K500CT-Walsin-Technologies-datasheet-26371553.pdf?src-supplier=Freelance+Electronics; ComponentLink12URL: http://datasheet.octopart.com/0402B104K500CT-Walsin-Technologies-datasheet-26371553.pdf?src-supplier=Component+Sense; ComponentLink12Description: http://datasheet.octopart.com/0402B104K500CT-Walsin-Technologies-datasheet-26371553.pdf?src-supplier=Component+Sense; ComponentLink13URL: http://datasheet.octopart.com/0402B104K500CT-Walsin-Technologies-datasheet-26371553.pdf?src-supplier=NAC+Semi; ComponentLink13Description: http://datasheet.octopart.com/0402B104K500CT-Walsin-Technologies-datasheet-26371553.pdf?src-supplier=NAC+Semi; ComponentLink14URL: https://datasheet.octopart.com/0402B104K500CT-Walsin-Technologies-datasheet-136037192.pdf?src-supplier=TECHDesign; ComponentLink14Description: https://datasheet.octopart.com/0402B104K500CT-Walsin-Technologies-datasheet-136037192.pdf?src-supplier=TECHDesign; Supplier 1: Digikey; Supplier Part Number 1: 1292-1176-1-ND
C28 C38 C43 C44 C47 = CAP0603-10uF-10V: CAP CER 10UF 10V X7R 0603; Manufacturer: Murata; Manufacturer Part Number: GRM188Z71A106KA73D; Material: 4241ConductorMaterial; Tolerance: 10%; Capacitance: 10uF; Supplier: Digikey; Supplier Part Number: 490-GRM188Z71A106KA73DDKR-ND; RoHS: Yes; Category: Ceramic Capacitors; Pricing: 1=0,28, 10=0,166, 100=0,1065, 1000=0,07585 (USD); Case/Package: 345Case; Min Operating Temperature: -55°C; Max Operating Temperature: 125°C; Value: 10uF; Voltage Rating: 10V; Length: 1.6mm; Width: 800um; Height: 1mm; Thickness: 800um; RoHS Compliant: Yes; ComponentLink1URL: https://datasheet.octopart.com/GRM188Z71A106KA73D-Murata-datasheet-165579666.pdf?src-supplier=TME; ComponentLink1Description: https://datasheet.octopart.com/GRM188Z71A106KA73D-Murata-datasheet-165579666.pdf?src-supplier=TME; Supplier 1: Digikey; Supplier Part Number 1: 490-GRM188Z71A106KA73DDKR-ND
FB1 = FBMH1608HL121-T: FERRITE BEAD 120 OHM 0603 1LN; Manufacturer: Taiyo Yuden; Supplier: Digikey; Supplier Part Number: 587-1731-1-ND; Manufacturer Part Number: FBMH1608HL121-T; RoHS: Yes; Category: Ferrite Beads and Chips; Stock: 4210; Pricing: 1=0,17, 10=0,118, 25=0,1024, 50=0,0916, 100=0,082, 250=0,07028, 500=0,06222, 1000=0,05476 (USD); ComponentLink1URL: https://datasheet.ciiva.com/16001/104fbmh1608hl121-t-16001055.pdf?src-supplier=Onlinecomponents.com; ComponentLink1Description: https://datasheet.ciiva.com/16001/104fbmh1608hl121-t-16001055.pdf?src-supplier=Onlinecomponents.com; ComponentLink2URL: https://datasheet.ciiva.com/7966/fbmh1608hl121-t-ss-7966161.pdf?src-supplier=Element14; ComponentLink2Description: https://datasheet.ciiva.com/7966/fbmh1608hl121-t-ss-7966161.pdf?src-supplier=Element14; ComponentLink3URL: https://datasheet.ciiva.com/30209/fbmh1608hl121-t-30209463.pdf?src-supplier=Onlinecomponents.com; ComponentLink3Description: https://datasheet.ciiva.com/30209/fbmh1608hl121-t-30209463.pdf?src-supplier=Onlinecomponents.com; ComponentLink4URL: https://datasheet.ciiva.com/25612/0900766b810b37be-25612388.pdf?src-supplier=Rs; ComponentLink4Description: https://datasheet.ciiva.com/25612/0900766b810b37be-25612388.pdf?src-supplier=Rs; ComponentLink5URL: https://datasheet.ciiva.com/1012/chipbeads01-e-1012500.pdf?src-supplier=Digikey; ComponentLink5Description: https://datasheet.ciiva.com/1012/chipbeads01-e-1012500.pdf?src-supplier=Digikey; ComponentLink6URL: https://datasheet.ciiva.com/1012/chipbeads01-e-1012501.pdf?src-supplier=Digikey; ComponentLink6Description: https://datasheet.ciiva.com/1012/chipbeads01-e-1012501.pdf?src-supplier=Digikey; ComponentLink7URL: https://datasheet.ciiva.com/1012/chipbeads01-e-1012502.pdf?src-supplier=Digikey; ComponentLink7Description: https://datasheet.ciiva.com/1012/chipbeads01-e-1012502.pdf?src-supplier=Digikey; Supplier 1: Digikey; Supplier Part Number 1: 587-1731-1-ND
R34 R35 = RES0402-10k-1%: Res Thick Film 0402 10K Ohm 1% 0.063W(1/16W) ±100ppm/C Pad SMD T/R Automotive AEC-Q200; Manufacturer: Vishay; Manufacturer Part Number: CRCW040210K0FKEE; Resistance: 10kΩ; Max Power Dissipation: 63mW; Value: 10kΩ; Temperature Coefficient: 100ppm/°C; Voltage Rating: 50V; Supplier 1: DigiKey; Supplier Part Number 1: 541-2954-1-ND; Supplier: DigiKey; Supplier Part Number: 541-2954-1-ND; RoHS: Compliant; Category: Chip SMD Resistors; Pricing: 1=0,1, 10=0,03, 25=0,0224, 50=0,018, 100=0,0148, 250=0,01156, 500=0,00974, 1000=0,00832, 5000=0,00637 (USD); Case/Package: 0402; Case Code (Imperial): 0402; Case Code (Metric): 1005; China RoHS: Non-Compliant; Composition: Thick Film; Contact Plating: Tin; Depth: 500µm; Features: Automotive AEC-Q200; Height: 350µm; Lead Free: Lead Free; Length: 990.6µm; Lifecycle Status: Production; Max Operating Temperature: 155°C; Military Standard: Not; Min Operating Temperature: -55°C; Mounting Technology: Surface Mount; Number of Terminals: 2; Number of Terminations: 2; Packaging: Tape & Reel; Power Dissipation: 63mW; Power Rating: 63mW; Radiation Hardening: No; REACH SVHC: Yes; Schedule B: 8533210045, 8533210045|8533210045|8533210045|8533210045|8533210045|8533210045|8533210045|8533210045|8533210045|8533210045|8533210045|8533210045|8533210045|8533210045|8533210045|8533210045|8533210045|8533210045|8533210045|8533210045|8533210045|8533210045|8533210045|85; Tolerance: 1%; Voltage Rating (DC): 50V; Width: 500µm; Working Voltage: 50V; ComponentLink1URL: https://datasheet.octopart.com:443/CRCW040210K0FKEE-Vishay-datasheet-175423584.pdf?src-supplier=IHS; ComponentLink1Description: https://datasheet.octopart.com:443/CRCW040210K0FKEE-Vishay-datasheet-175423584.pdf?src-supplier=IHS; ComponentLink2URL: https://datasheet.octopart.com:443/CRCW040210K0FKEE-Vishay-datasheet-62316122.pdf?src-supplier=Future+Electronics; ComponentLink2Description: https://datasheet.octopart.com:443/CRCW040210K0FKEE-Vishay-datasheet-62316122.pdf?src-supplier=Future+Electronics; ComponentLink3URL: http://sigma.octopart.com:80/rohs_statement/Vishay-company-15.pdf?src-supplier=Compliance+Statements; ComponentLink3Description: http://sigma.octopart.com:80/rohs_statement/Vishay-company-15.pdf?src-supplier=Compliance+Statements
U7 = F28P650DK6NMRR_1: as U7 on sheet Mcu; Supplier 1: DigiKey; Supplier Part Number 1: 296-F28P650DK6NMRRTR-ND; Supplier: DigiKey; Supplier Part Number: 296-F28P650DK6NMRRTR-ND; Manufacturer Part Number: F28P650DK6NMRR; RoHS: Compliant; Category: Microcontrollers; Pricing: 1000=11,46098 (USD); Height: 0m; Length: 9mm; Lifecycle Status: Production; Pins: 169; Thickness: 650µm; Width: 9mm; ComponentLink1URL: https://sigma.octopart.com:443/170336436/technical_drawing/Texas-Instruments-F28P650DK6NMRR.pdf?src-supplier=Texas+Instruments; ComponentLink1Description: https://sigma.octopart.com:443/170336436/technical_drawing/Texas-Instruments-F28P650DK6NMRR.pdf?src-supplier=Texas+Instruments; ComponentLink2URL: https://octopart.com:443/opatz8j6/c1?t=APRw11tpYPVjWCcH60awOXt0cGwImscANGC7li7_cx_Agxm915MhAZTObmDghc9eZOaw_mHD48OCZSRp73lGddKWUBe5fw7JdS3oY6-WaShYciiLLEgoA4x4huAl_qcDmd35tthWJciG_j9G0_KiT0SpOlZap5xOApFweMh2aZbGRedpPOVXVEDON4Icb6hkm9W7qm4-y49tBp6shpQILr3wInC47Ns5REcOk_fqp6GFBCGfdNNlvimY7LhF-z2TQJYRCUXuPMF8jbjKwibXb4IEVHm3troRaaxBm4vGhw5rMNpdyp6Yfknc0rFnvpyRKpgralAt9vXUJ0VNHXN8-zHJova3rwODBasGVAO6XlgY1J4nqzjFJr64ola8gSl7fMvjJfjBTM6KoBMDgg&src-supplier=Texas+Instruments; ComponentLink2Description: https://octopart.com:443/opatz8j6/c1?t=APRw11tpYPVjWCcH60awOXt0cGwImscANGC7li7_cx_Agxm915MhAZTObmDghc9eZOaw_mHD48OCZSRp73lGddKWUBe5fw7JdS3oY6-WaShYciiLLEgoA4x4huAl_qcDmd35tthWJciG_j9G0_KiT0SpOlZap5xOApFweMh2aZbGRedpPOVXVEDON4Icb6hkm9W7qm4-y49tBp6shpQILr3wInC47Ns5REcOk_fqp6GFBCGfdNNlvimY7LhF-z2TQJYRCUXuPMF8jbjKwibXb4IEVHm3troRaaxBm4vGhw5rMNpdyp6Yfknc0rFnvpyRKpgralAt9vXUJ0VNHXN8-zHJova3rwODBasGVAO6XlgY1J4nqzjFJr64ola8gSl7fMvjJfjBTM6KoBMDgg&src-supplier=Texas+Instruments; ComponentLink3URL: http://sigma.octopart.com:80/reach_statement/Texas-Instruments-company-64.pdf?src-supplier=Compliance+Statements; ComponentLink3Description: http://sigma.octopart.com:80/reach_statement/Texas-Instruments-company-64.pdf?src-supplier=Compliance+Statements; ComponentLink4URL: http://sigma.octopart.com:80/conflict_mineral_statement/Texas-Instruments-company-63.pdf?src-supplier=Compliance+Statements; ComponentLink4Description: http://sigma.octopart.com:80/conflict_mineral_statement/Texas-Instruments-company-63.pdf?src-supplier=Compliance+Statements